# EAGLE design FenixCaseMixer (EAGLE 7.7.0)
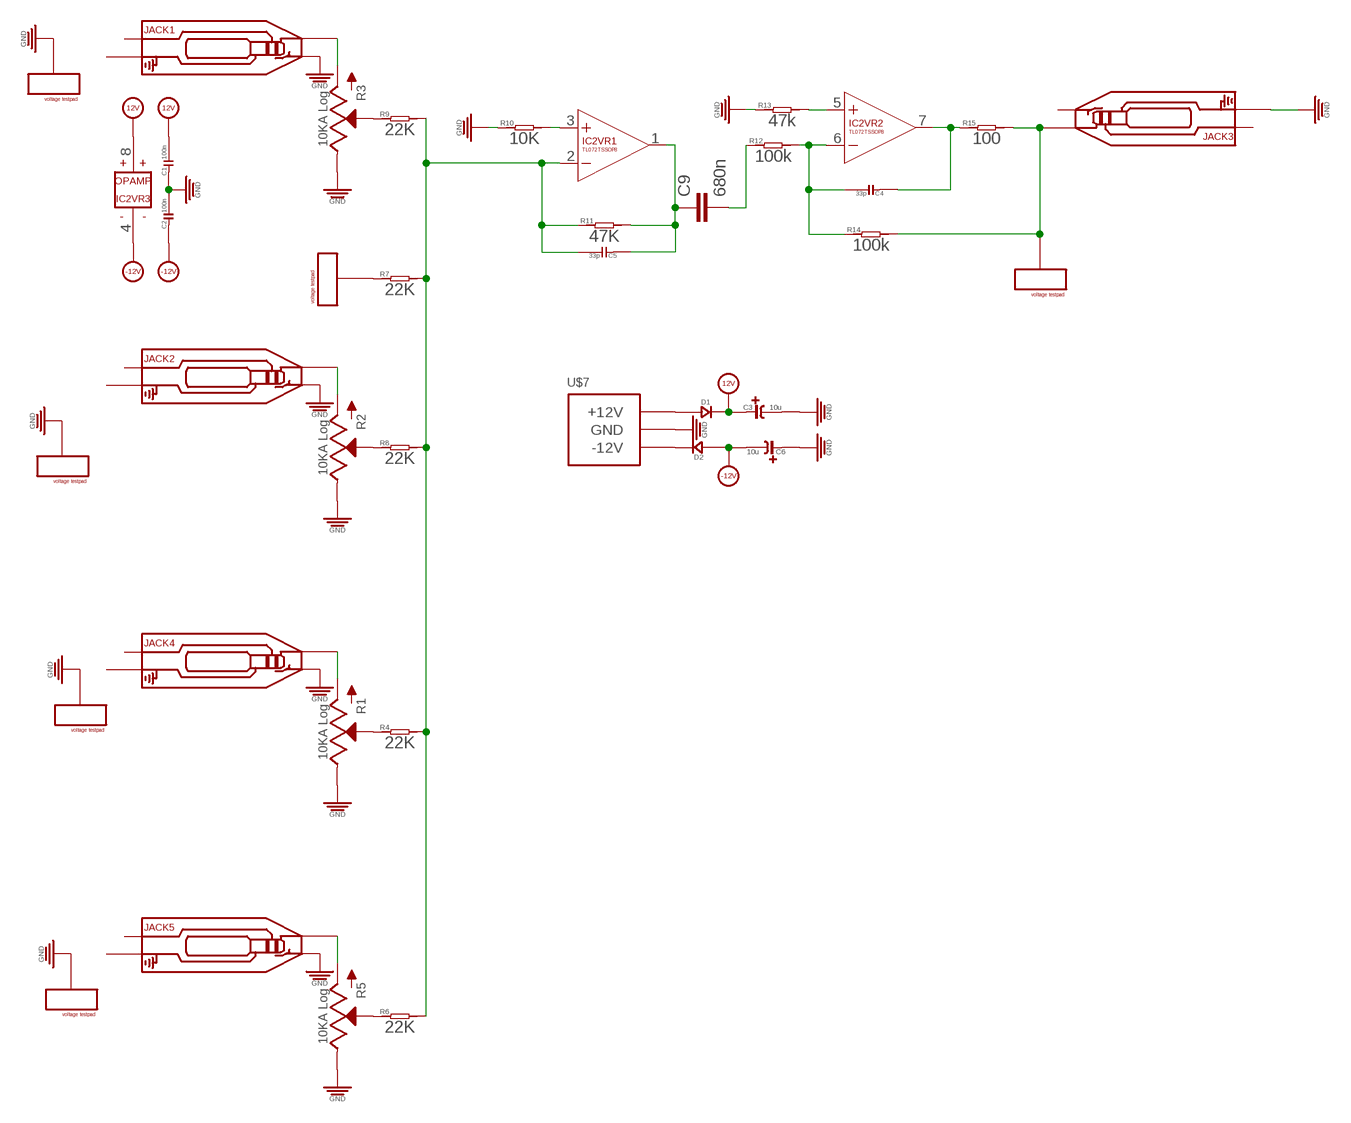
[diagram p0: schematic, sheet 1]

## Parts
C1  100n  C-0603  [C0603]
C2  100n  C-0603  [C0603]
C3  10u  C-POLAR-A  [CASE-A_3216]
C4  33p  C-0603  [C0603]
C5  33p  C-0603  [C0603]
C6  10u  C-POLAR-A  [CASE-A_3216]
C9  680n  C5/4.5  [C5B4.5]
D1  D-SMA  [DO-214AC]
D2  D-SMA  [DO-214AC]
IC2  TL072TSSOP8  [TSSOP8]
JACK1  AUDIO-JACK_SMALLSYMBOL  [3.5MM-JACK-SWITCH-13MM-NOHOLES-TESTPAD]
JACK2  AUDIO-JACK_SMALLSYMBOL  [3.5MM-JACK-SWITCH-13MM-NOHOLES-TESTPAD]
JACK3  AUDIO-JACK_SMALLSYMBOL  [3.5MM-JACK-SWITCH-13MM-NOHOLES-TESTPAD]
JACK4  AUDIO-JACK_SMALLSYMBOL  [3.5MM-JACK-SWITCH-13MM-NOHOLES-TESTPAD]
JACK5  AUDIO-JACK_SMALLSYMBOL  [3.5MM-JACK-SWITCH-13MM-NOHOLES-TESTPAD]
R1  10KA Log  POTSQUAREHOLE_SMALLKNOB  [ALPS_POT_SQUAREHOLES]
R2  10KA Log  POTSQUAREHOLE_SMALLKNOB  [ALPS_POT_SQUAREHOLES]
R3  10KA Log  POTSQUAREHOLE_SMALLKNOB  [ALPS_POT_SQUAREHOLES]
R4  22K  R-0603  [R0603]
R5  10KA Log  POTSQUAREHOLE_SMALLKNOB  [ALPS_POT_SQUAREHOLES]
R6  22K  R-0603  [R0603]
R7  22K  R-0603  [R0603]
R8  22K  R-0603  [R0603]
R9  22K  R-0603  [R0603]
R10  10K  R-0603  [R0603]
R11  47K  R-0603  [R0603]
R12  100k  R-0603  [R0603]
R13  47k  R-0603  [R0603]
R14  100k  R-0603  [R0603]
R15  100  R-0603  [R0603]
U$5  VOLTAGETESTPAD_BIG  [POWERTESTPAD_BIG]
U$6  VOLTAGETESTPAD_BIG  [POWERTESTPAD_BIG]
U$7  POWER_SIMPLE10  [POWER_10]
U$10  VOLTAGETESTPAD  [POWERTESTPAD]
U$11  VOLTAGETESTPAD  [POWERTESTPAD]
U$12  VOLTAGETESTPAD  [POWERTESTPAD]
U$13  VOLTAGETESTPAD  [POWERTESTPAD]

## Nets
12V [power]: C1.2 C3.+ D1.2(-) IC2.8(VR3:V+)
-12V [power]: C2.1 C6.- D2.1(+) IC2.4(VR3:V-)
GND: C1.1 C2.2 C3.- C6.+ JACK1.SWITCH_B@1(SWITCH) JACK1.SWITCH_T@3(SWITCH) JACK2.SWITCH_B@1(SWITCH) JACK2.SWITCH_T@3(SWITCH) JACK3.RING_B@1(RING) JACK3.RING_T@3(RING) JACK4.SWITCH_B@1(SWITCH) JACK4.SWITCH_T@3(SWITCH) JACK5.SWITCH_B@1(SWITCH) JACK5.SWITCH_T@3(SWITCH) R1.P$1(E) R2.P$1(E) R3.P$1(E) R5.P$1(E) R10.1 R13.1 U$7.3(GND) U$7.4(GND) U$7.5(GND) U$7.6(GND) U$7.7(GND) U$7.8(GND) U$10.P$1(VOLTAGE) U$10.P$2(VOLTAGE) U$10.P$3(VOLTAGE) U$11.P$1(VOLTAGE) U$11.P$2(VOLTAGE) U$11.P$3(VOLTAGE) U$12.P$1(VOLTAGE) U$12.P$2(VOLTAGE) U$12.P$3(VOLTAGE) U$13.P$1(VOLTAGE) U$13.P$2(VOLTAGE) U$13.P$3(VOLTAGE)
MIXO: JACK3.TIP_B@1(TIP) JACK3.TIP_T@3(TIP) R14.2 R15.2 U$6.P$1(VOLTAGE) U$6.P$2(VOLTAGE) U$6.P$3(VOLTAGE)
N$1: JACK1.TIP_B@1(TIP) JACK1.TIP_T@3(TIP) R3.P$3(A)
N$2: JACK2.TIP_B@1(TIP) JACK2.TIP_T@3(TIP) R2.P$3(A)
N$3: JACK4.TIP_B@1(TIP) JACK4.TIP_T@3(TIP) R1.P$3(A)
N$4: R1.P$2(S) R4.1
N$5: R7.1 U$5.P$1(VOLTAGE) U$5.P$2(VOLTAGE) U$5.P$3(VOLTAGE)
N$6: JACK5.TIP_B@1(TIP) JACK5.TIP_T@3(TIP) R5.P$3(A)
N$7: R2.P$2(S) R8.1
N$8: C5.2 IC2.2(VR1:-IN) R4.2 R6.2 R7.2 R8.2 R9.2 R11.1
N$9: R3.P$2(S) R9.1
N$10: IC2.3(VR1:+IN) R10.2
N$11: C5.1 C9.1 IC2.1(VR1:OUT) R11.2
N$12: IC2.5(VR2:+IN) R13.2
N$13: C4.2 IC2.6(VR2:-IN) R12.2 R14.1
N$14: C4.1 IC2.7(VR2:OUT) R15.1
N$15: C9.2 R12.1
N$16: R5.P$2(S) R6.1
N$17: D1.1(+) U$7.9(+12V) U$7.10(+12V)
N$18 [power]: D2.2(-) U$7.1(-12V) U$7.2(-12V)
Unconnected: JACK1.RING_B@1(RING) JACK1.RING_T@3(RING) JACK1.SECOND_B@1(SECOND) JACK1.SECOND_T@3(SECOND) JACK2.RING_B@1(RING) JACK2.RING_T@3(RING) JACK2.SECOND_B@1(SECOND) JACK2.SECOND_T@3(SECOND) JACK3.SECOND_B@1(SECOND) JACK3.SECOND_T@3(SECOND) JACK3.SWITCH_B@1(SWITCH) JACK3.SWITCH_T@3(SWITCH) JACK4.RING_B@1(RING) JACK4.RING_T@3(RING) JACK4.SECOND_B@1(SECOND) JACK4.SECOND_T@3(SECOND) JACK5.RING_B@1(RING) JACK5.RING_T@3(RING) JACK5.SECOND_B@1(SECOND) JACK5.SECOND_T@3(SECOND)

## Library data of the parts
C1 C2 C4 C5 = OPL:C*
C3 C6 = EurorackModularParts:C-POLAR*
C9 = capacitor-wima:C: CAPACITOR naming: grid - package width
D1 D2 = OPL:D*: DIODE
IC2 = EurorackModularParts:TL072
JACK1 = EurorackModularParts:AUDIO-JACK_SMALLSYMBOL: Switching Mono 3.5mm Audio Jack from Erthenvar.; DESC: A
JACK2 = EurorackModularParts:AUDIO-JACK_SMALLSYMBOL: Switching Mono 3.5mm Audio Jack from Erthenvar.; DESC: B
JACK3 = EurorackModularParts:AUDIO-JACK_SMALLSYMBOL: Switching Mono 3.5mm Audio Jack from Erthenvar.; DESC: Out
JACK4 = EurorackModularParts:AUDIO-JACK_SMALLSYMBOL: Switching Mono 3.5mm Audio Jack from Erthenvar.; DESC: C
JACK5 = EurorackModularParts:AUDIO-JACK_SMALLSYMBOL: Switching Mono 3.5mm Audio Jack from Erthenvar.; DESC: D
R1 = EurorackModularParts:POT; DESC: C
R2 = EurorackModularParts:POT; DESC: B
R3 = EurorackModularParts:POT; DESC: A
R4 R6-R15 = OPL:R*
R5 = EurorackModularParts:POT; DESC: D
U$5 = FenixBase:VOLTAGETESTPAD; DESC: IN
U$6 = FenixBase:VOLTAGETESTPAD; DESC: OUT
U$7 = EurorackModularParts:POWER_SIMPLE
U$10-U$13 = FenixBase:VOLTAGETESTPAD; DESC: gnd

## Net classes
0 default: width 0.254 mm
1 power: width 0.381 mm

## Board
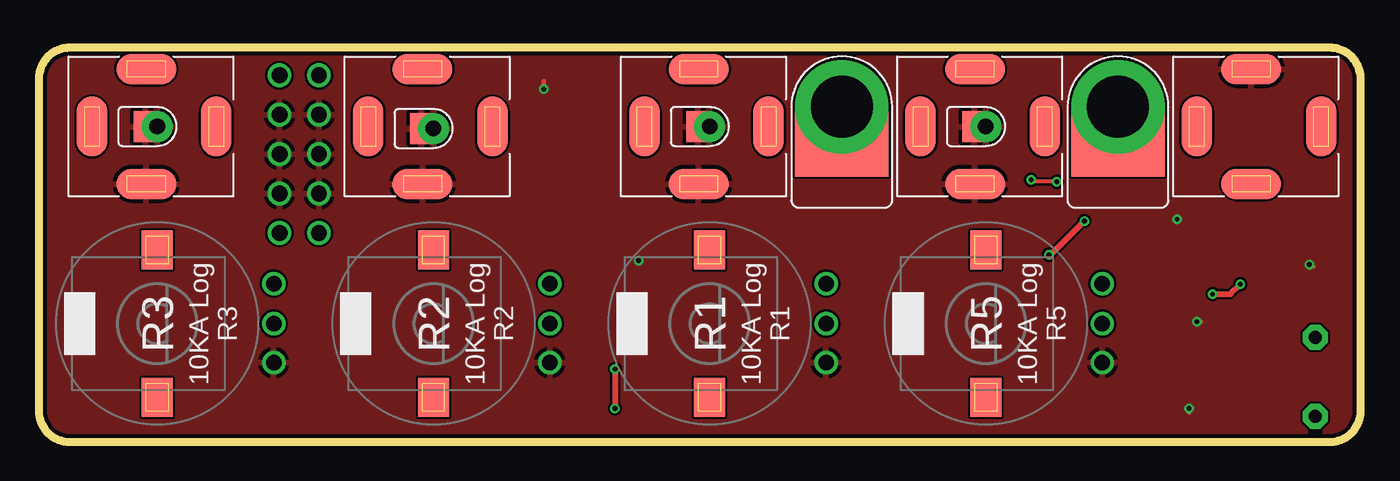
[diagram p1: board, top side]
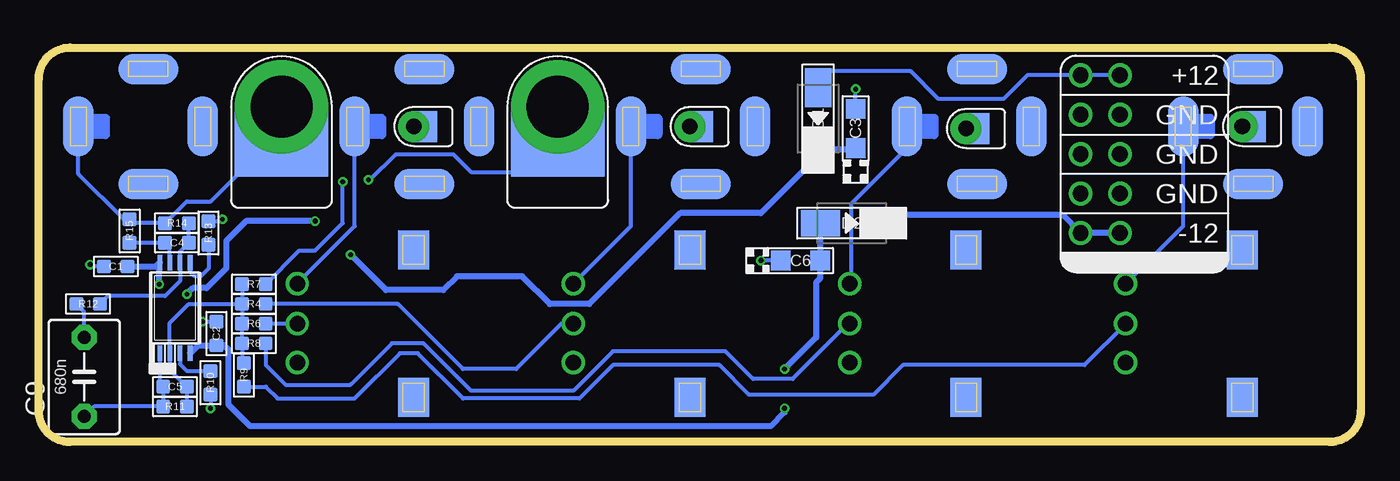
[diagram p2: board, bottom side, seen from below]

Size 85.09 x 25.4 mm. Coordinates in mm from the lower left corner, seen from the top.
Outline: 2,0 83.09,0 arc90 85.09,2 85.09,23.4 arc90 83.09,25.4 2,25.4 arc90 0,23.4 0,2 arc90 2,0
Copper layers (1*16): Top 0.035mm / dielectric 1.5mm / Bottom 0.035mm
Design rules "dirt_cheap_dirty_boards.v1.1": minimum track width 6mil, minimum drill 12mil, track to track 6mil, track to pad 6mil, pad to pad 6mil, via to via 6mil, smd to smd 0mil, copper to edge 10mil, drill to drill 10mil, minimum pad ring 10mil, minimum via ring 6mil, stop-mask expansion 2mil, vias tented up to drill 25mil, thermal gap 10mil

### Footprints (pad centres in the part's own frame; a part is rotated, then mirrored left to right if it is on the bottom)
C0603 = smd 0.889 x 0.889: 1 -0.762,0; 2 0.762,0
CASE-A_3216 = smd 1.27 x 1.27: + -1.27,0; - 1.27,0
C5B4.5 = drill 0.813 pad 1.6 octagon: 1 -2.54,0; 2 2.54,0
DO-214AC = smd 2.5 x 1.7: 1 -2,0; 2 2,0
TSSOP8 = smd 0.305 x 0.991: 1 -0.975,-2.918; 2 -0.325,-2.918; 3 0.325,-2.918; 4 0.975,-2.918; 5 0.975,2.918; 6 0.325,2.918; 7 -0.325,2.918; 8 -0.975,2.918
3.5MM-JACK-SWITCH-13MM-NOHOLES-TESTPAD = smd 1.95 x 3.85 bottom: RING_B@1 -3.7,-0.7; SWITCH_B@1 3.7,-0.7 | smd 1.95 x 3.85: RING_T@3 -3.7,-0.7; SWITCH_T@3 3.7,-0.7 | smd 3.85 x 1.95 bottom: SECOND_B@1 0,-4.2; TIP_B@1 0,3.8 | smd 3.85 x 1.95: SECOND_T@3 0,-4.2; TIP_T@3 0,3.8
ALPS_POT_SQUAREHOLES = drill 1: P$1 -2.5,-7.5; P$2 0,-7.5; P$3 2.58,-7.5 | smd 2.5 x 2: P$4 -4.75,0; P$5 4.75,0 | smd 2.5 x 2 bottom: P$6 -4.75,0; P$7 4.75,0
R0603 = smd 0.889 x 0.889: 1 -0.762,0; 2 0.762,0
POWERTESTPAD_BIG = drill 4 pad 6: P$1 0,0 | smd 6 x 4.5: P$2 0,-2.25 | smd 6 x 4.5 bottom: P$3 0,-2.25
POWER_10 = drill 1.016: 1 -5.08,-1.27; 2 -5.08,1.27; 3 -2.54,-1.27; 4 -2.54,1.27; 5 0,-1.27; 6 0,1.27; 7 2.54,-1.27; 8 2.54,1.27; 9 5.08,-1.27; 10 5.08,1.27
POWERTESTPAD = drill 1 pad 2: P$1 0,0 | smd 2 x 1.5: P$2 0,-0.75 | smd 2 x 1.5 bottom: P$3 0,-0.75

### Placement (x,y rotation side)
C1  80.14,11.3 0 bottom
C2  73.66,6.98 90 bottom
C3  32.51,20.19 90 bottom
C4  76.2,12.83 0 bottom
C5  76.33,3.56 0 bottom
C6  36.07,11.68 0 bottom
C9  82.17,4.19 90 bottom
D1  34.92,20.83 270 bottom
D2  32.77,14.1 0 bottom
IC2  76.33,8.64 0 bottom
JACK1  7.62,20.32 270 top
JACK2  25.4,20.32 270 top
JACK3  78.74,20.32 270 top
JACK4  43.18,20.32 270 top
JACK5  60.96,20.32 270 top
R1  43.18,7.62 90 top
R2  25.4,7.62 90 top
R3  7.62,7.62 90 top
R4  71.25,8.89 180 bottom
R5  60.96,7.62 90 top
R6  71.25,7.62 180 bottom
R7  71.25,10.16 180 bottom
R8  71.25,6.35 180 bottom
R9  71.88,4.32 90 bottom
R10  74.04,3.81 90 bottom
R11  76.33,2.29 180 bottom
R12  81.92,8.89 0 bottom
R13  74.17,13.46 270 bottom
R14  76.2,14.1 180 bottom
R15  79.25,13.59 90 bottom
U$5  51.69,21.59 0 top
U$6  69.47,21.59 0 top
U$7  16.76,18.54 90 bottom
U$10  7.62,20.32 270 top
U$11  60.96,20.32 270 top
U$12  25.4,20.19 270 top
U$13  43.18,20.32 270 top

### Tracks (layer width: path | path; a pad name or v marks a point on that pad's centre or on a via)
12V  (via drill 0.3)
  Top 0.381: v65.02,12.06 65.15,12.06 v67.31,14.22 | v75.56,9.52 76.71,9.52 v77.34,10.16
  Bottom 0.381: C3.+ 32.61,18.83 D1.2 34.92,18.41 38.61,14.73 43.81,14.73 49.66,8.89 52.2,8.89 53.98,10.67 58.17,10.67 59.05,9.78 62.74,9.78 v65.02,12.06 | C1.2 77.55,11.3 IC2.8 77.34,11.51 v77.34,10.16 | v67.31,14.22 71.75,14.22 73.03,12.95 73.03,11.18 74.3,9.91 75.18,9.91 v75.56,9.52
-12V  (via drill 0.3)
  Top 0.381: v37.08,4.7 v37.08,2.16
  Bottom 0.381: D2.1 34.8,14.06 C6.- 34.8,10.54 35.05,10.29 35.05,6.73 v37.08,4.7 | IC2.4 74.85,6.22 C2.1 73.15,6.22 72.9,5.97 72.9,2.41 71.5,1.02 37.97,1.02 37.08,1.9 v37.08,2.16
GND  (via drill 0.3)
  Top 0.254: v32.51,22.73 32.51,23.24 | v38.61,11.68 38.73,11.68 | v81.79,11.43 81.92,11.43 82.04,11.3 | v74.55,7.75 74.8,7.75 | v74.04,2.16 74.04,1.9
  Bottom 0.254: C3.- v32.51,22.73 | C6.+ v38.61,11.68 | R13.1 73.41,14.22 v73.28,14.35 | C1.1 81.66,11.3 v81.79,11.43 | C2.2 v74.55,7.75 | R10.1 v74.04,2.16
  pour Top: 1.91,79.25 88.27,79.38 88.27,-3.81 -2.54,-3.94
MIXO
  Bottom 0.254: JACK3.TIP_B@1 82.55,17.27 79.63,14.35 R15.2 78.99,14.1 R14.2 75.56,15.49 74.04,15.49 70.48,19.05 70.36,19.05 68.96,20.45 68.96,19.85 U$6.P$2
N$1
  Bottom 0.254: R3.P$3 11.42,13.9 JACK1.TIP_B@1
N$2
  Bottom 0.254: R2.P$3 32.77,10.33 32.77,15.37 29.2,18.93 JACK2.TIP_B@1
N$3
  Bottom 0.254: R1.P$3 46.98,13.9 JACK4.TIP_B@1
N$4
  Bottom 0.254: R1.P$2 51.44,7.62 54.36,4.7 57.79,4.7 61.98,8.89 R4.1
N$5  (via drill 0.3)
  Top 0.254: v65.53,16.76 64.01,16.76 v63.88,16.89
  Bottom 0.254: R7.1 68.33,12.32 67.31,12.32 65.53,14.1 v65.53,16.76 | v63.88,16.89 63.75,16.89 62.1,18.54 58.42,18.54 57.28,17.4 52.2,17.4 50.42,19.18 50.42,20.32 U$5.P$1
N$6
  Bottom 0.254: R5.P$3 64.76,13.9 JACK5.TIP_B@1
N$7
  Bottom 0.254: R2.P$2 33.02,7.62 36.58,4.06 39.12,4.06 40.89,5.84 48.13,5.84 50.67,3.3 57.28,3.3 60.33,6.35 62.36,6.35 65.02,3.68 69.22,3.68 70.48,4.95 R8.1
N$8
  Bottom 0.254: R7.2 R4.2 | R11.1 C5.2 76.65,4.64 IC2.2 76.65,7.68 75.44,8.89 R4.2 | R4.2 R6.2 R8.2 72.01,5.21 R9.2
N$9
  Bottom 0.254: R3.P$2 17.78,4.95 29.46,4.95 31.37,3.05 39.37,3.05 41.28,4.95 48.13,4.95 50.29,2.79 57.79,2.79 60.71,5.71 61.85,5.71 64.77,2.79 69.72,2.79 70.48,3.56 R9.1
N$10
  Bottom 0.254: IC2.3 76,5.01 75.56,4.57 R10.2
N$11
  Bottom 0.254: IC2.1 77.3,3.77 C5.1 R11.2 81.53,2.29 C9.1
N$12
  Bottom 0.254: IC2.5 75.35,10.96 75.06,10.67 74.68,10.67 74.17,11.18 R13.2
N$13
  Bottom 0.254: R14.1 C4.2 76,12.26 IC2.6 76,10.36 76.96,9.4 80.65,9.4 R12.2
N$14
  Bottom 0.254: IC2.7 76.65,12.52 C4.1 R15.1
N$15
  Bottom 0.254: C9.2 82.17,8.38 R12.1
N$16
  Bottom 0.254: R6.1 R5.P$2
N$17
  Bottom 0.254: U$7.9 U$7.10 21.46,23.62 22.99,22.1 27.18,22.1 28.96,23.88 34.54,23.88 34.67,23.75 34.67,23.08 D1.1
N$18
  Bottom 0.381: U$7.1 U$7.2 19.18,14.6 29.97,14.6 30.48,14.1 D2.2